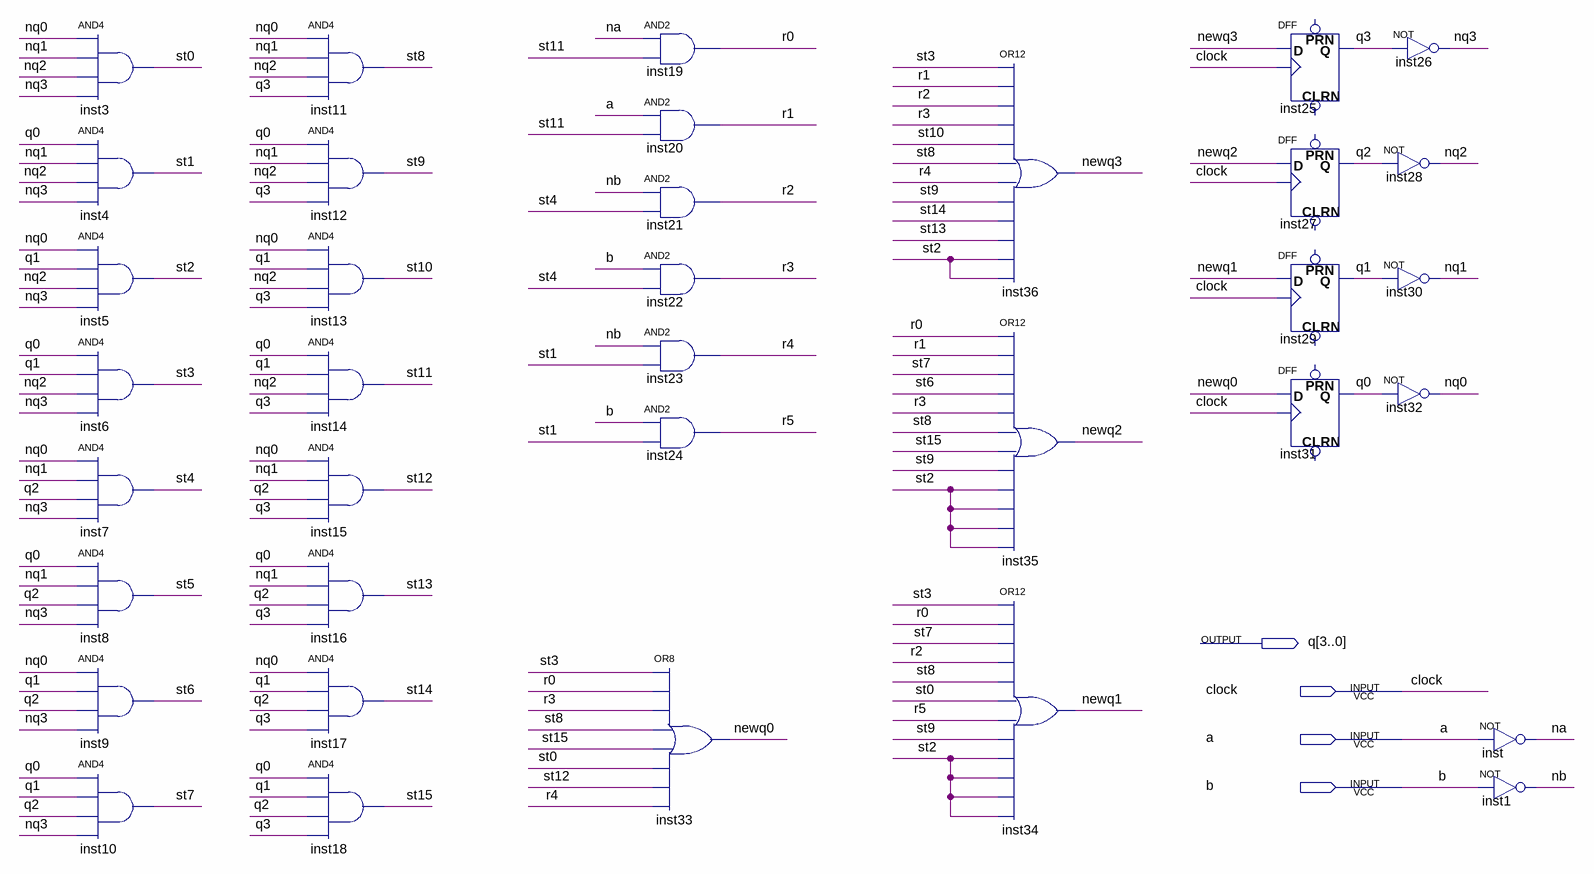
[diagram p0: schematic sheet]
// Quartus schematic lab41.bdf as structural Verilog: 36 symbols, 4 pins
module lab41 (
  input  clock,
  input  a,
  input  b,
  output [3:0] q
);

  wire na, nb, newq0, newq1, newq2, newq3, nq0, nq1, nq2, nq3, r0, r1, r2, r3, r4, r5, st0, st1, st2, st3,
       st4, st5, st6, st7, st8, st9, st10, st11, st12, st13, st14, st15;

  and inst3 (st0, nq0, nq1, nq2, nq3);
  and inst4 (st1, q[0], nq1, nq2, nq3);
  and inst5 (st2, nq0, q[1], nq2, nq3);
  and inst6 (st3, q[0], q[1], nq2, nq3);
  and inst7 (st4, nq0, nq1, q[2], nq3);
  and inst8 (st5, q[0], nq1, q[2], nq3);
  and inst9 (st6, nq0, q[1], q[2], nq3);
  and inst10 (st7, q[0], q[1], q[2], nq3);
  and inst11 (st8, nq0, nq1, nq2, q[3]);
  and inst12 (st9, q[0], nq1, nq2, q[3]);
  and inst13 (st10, nq0, q[1], nq2, q[3]);
  and inst14 (st11, q[0], q[1], nq2, q[3]);
  and inst15 (st12, nq0, nq1, q[2], q[3]);
  and inst16 (st13, q[0], nq1, q[2], q[3]);
  and inst17 (st14, nq0, q[1], q[2], q[3]);
  and inst18 (st15, q[0], q[1], q[2], q[3]);
  and inst19 (r0, na, st11);
  and inst20 (r1, a, st11);
  and inst21 (r2, nb, st4);
  and inst22 (r3, b, st4);
  and inst23 (r4, nb, st1);
  and inst24 (r5, b, st1);
  or inst33 (newq0, st3, r0, r3, st8, st15, st0, st12, r4);
  or inst36 (newq3, st3, r1, r2, r3, st10, st8, r4, st9, st14, st13, st2, st2);
  or inst35 (newq2, r0, r1, st7, st6, r3, st8, st15, st9, st2, st2, st2, st2);
  or inst34 (newq1, st3, r0, st7, r2, st8, st0, r5, st9, st2, st2, st2, st2);
  DFF inst25 (.CLK(clock), .D(newq3), .Q(q[3]));  // open: CLRN, PRN
  DFF inst27 (.CLK(clock), .D(newq2), .Q(q[2]));  // open: CLRN, PRN
  DFF inst29 (.CLK(clock), .D(newq1), .Q(q[1]));  // open: CLRN, PRN
  DFF inst31 (.CLK(clock), .D(newq0), .Q(q[0]));  // open: CLRN, PRN
  not inst28 (nq2, q[2]);
  not inst30 (nq1, q[1]);
  not inst32 (nq0, q[0]);
  not inst26 (nq3, q[3]);
  not inst (na, a);
  not inst1 (nb, b);
endmodule
